# Altium schematic sheet mcu.SchDoc
size A4; SheetNumber: 2; SheetTotal: 8
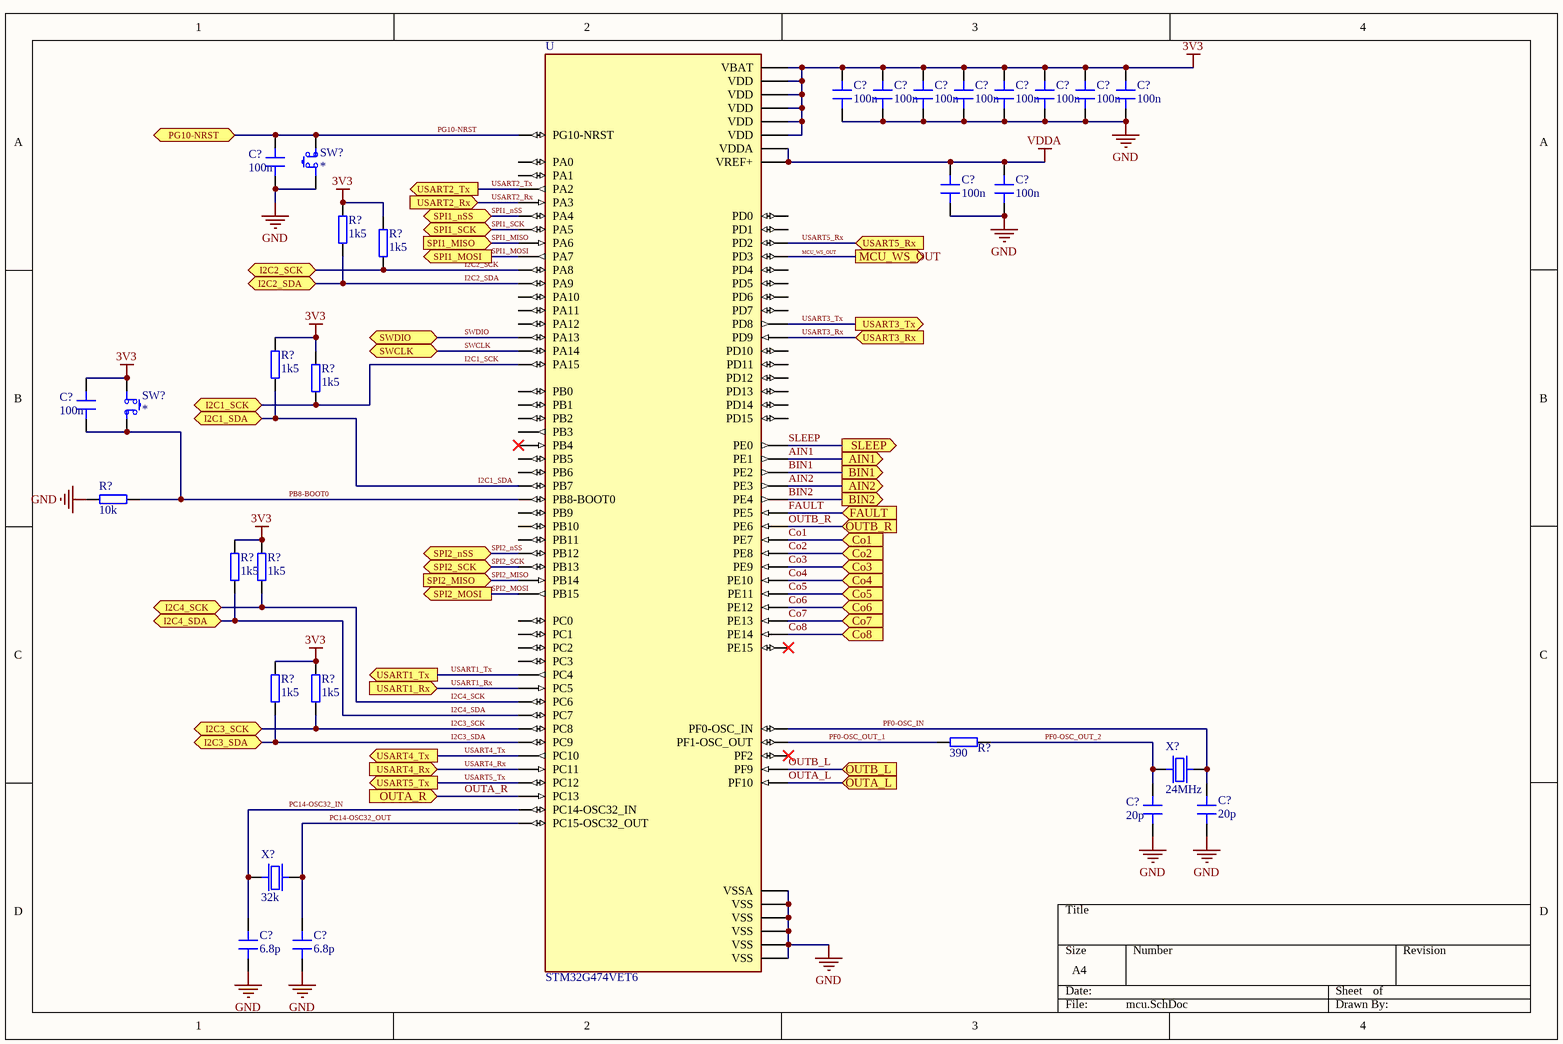
[diagram p0: mcu.SchDoc]

## Parts
(Parts that share a designator on the sheet are numbered #1, #2 ... from top to bottom, then left to right.)
C?#1  100n
C?#2  100n
C?#3  100n
C?#4  100n
C?#5  100n
C?#6  100n
C?#7  100n
C?#8  100n
C?#9  100n
C?#10  100n
C?#11  100n
C?#12  100n
C?#13  20p
C?#14  20p
C?#15  6.8p
C?#16  6.8p
R?#1  1k5
R?#2  1k5
R?#3  1k5
R?#4  1k5
R?#5  10k
R?#6  1k5
R?#7  1k5
R?#8  1k5
R?#9  1k5
R?#10  390
SW?#1  *
SW?#2  *
U  STM32G474VET6  [QFP50P1600X1600X160-100N]
X?#1  24MHz
X?#2  32k

## Ports
AIN1 (out), AIN2 (out), BIN1 (out), BIN2 (out), Co1 (in), Co2 (in), Co3 (in), Co4 (in), Co5 (in), Co6 (in), Co7 (in), Co8 (in), FAULT (in), I2C1_SCK (bidir, see mainSchema[3B]), I2C1_SDA (bidir, see mainSchema[3B]), I2C2_SCK (bidir, see mainSchema[3B]), I2C2_SDA (bidir, see mainSchema[3B]), I2C3_SCK (bidir, see mainSchema[3B]), I2C3_SDA (bidir, see mainSchema[3B]), I2C4_SCK (bidir, see mainSchema[3B]), I2C4_SDA (bidir, see mainSchema[3B]), MCU_WS_OUT (out), OUTA_L (in), OUTA_R (in), OUTB_L (in), OUTB_R (in), PG10-NRST (bidir, see mainSchema[3A]), SLEEP (out), SPI1_MISO (in, see mainSchema[3B]), SPI1_MOSI (out, see mainSchema[3C]), SPI1_nSS (bidir, see mainSchema[3B]), SPI1_SCK (bidir, see mainSchema[3B]), SPI2_MISO (in, see mainSchema[3C]), SPI2_MOSI (out, see mainSchema[3C]), SPI2_nSS (bidir, see mainSchema[3C]), SPI2_SCK (bidir, see mainSchema[3C]), SWCLK (bidir, see mainSchema[3A], SWD[2A]), SWDIO (bidir, see mainSchema[3A], SWD[2A]), USART1_Rx (in, see mainSchema[3A]), USART1_Tx (out, see mainSchema[3A]), USART2_Rx (in, see mainSchema[3A]), USART2_Tx (out, see mainSchema[3A]), USART3_Rx (in, see mainSchema[3A]), USART3_Tx (out, see mainSchema[3A]), USART4_Rx (in, see mainSchema[3A]), USART4_Tx (out, see mainSchema[3A]), USART5_Rx (in, see mainSchema[3B]), USART5_Tx (out, see mainSchema[3B])

## Nets
3V3: C?#1.2 C?#2.2 C?#3.2 C?#4.2 C?#5.2 C?#6.2 C?#7.2 C?#8.2 C?#12.1 R?#1.2 R?#2.2 R?#3.2 R?#4.2 R?#6.2 R?#7.2 R?#8.2 R?#9.2 SW?#2.1 U.6(VBAT) U.24(VDD) U.49(VDD) U.64(VDD) U.75(VDD) U.100(VDD)
GND: C?#1.1 C?#2.1 C?#3.1 C?#4.1 C?#5.1 C?#6.1 C?#7.1 C?#8.1 C?#9.2 C?#10.1 C?#11.1 C?#13.1 C?#14.1 C?#15.1 C?#16.1 R?#5.2 SW?#1.1 U.23(VSS) U.35(VSSA) U.48(VSS) U.63(VSS) U.74(VSS) U.99(VSS)
VDDA: C?#10.2 C?#11.2 U.36(VREF+) U.37(VDDA)
AIN1: U.98(PE1) ; port AIN1
AIN2: U.2(PE3) ; port AIN2
BIN1: U.1(PE2) ; port BIN1
BIN2: U.3(PE4) ; port BIN2
Co1: U.38(PE7) ; port Co1
Co2: U.39(PE8) ; port Co2
Co3: U.40(PE9) ; port Co3
Co4: U.41(PE10) ; port Co4
Co5: U.42(PE11) ; port Co5
Co6: U.43(PE12) ; port Co6
Co7: U.44(PE13) ; port Co7
Co8: U.45(PE14) ; port Co8
FAULT: U.4(PE5) ; port FAULT
I2C1_SCK: R?#4.1 U.78(PA15) ; port I2C1_SCK
I2C1_SDA: R?#3.1 U.94(PB7) ; port I2C1_SDA
I2C2_SCK: R?#2.1 U.69(PA8) ; port I2C2_SCK
I2C2_SDA: R?#1.1 U.70(PA9) ; port I2C2_SDA
I2C3_SCK: R?#9.1 U.67(PC8) ; port I2C3_SCK
I2C3_SDA: R?#8.1 U.68(PC9) ; port I2C3_SDA
I2C4_SCK: R?#7.1 U.65(PC6) ; port I2C4_SCK
I2C4_SDA: R?#6.1 U.66(PC7) ; port I2C4_SDA
MCU_WS_OUT: U.85(PD3) ; port MCU_WS_OUT
OUTA_L: U.11(PF10) ; port OUTA_L
OUTA_R: U.7(PC13) ; port OUTA_R
OUTB_L: U.10(PF9) ; port OUTB_L
OUTB_R: U.5(PE6) ; port OUTB_R
PB8-BOOT0: C?#12.2 R?#5.1 SW?#2.2 U.95(PB8-BOOT0)
PC14-OSC32_IN: C?#15.2 U.8(PC14-OSC32_IN) X?#2.1
PC14-OSC32_OUT: C?#16.2 U.9(PC15-OSC32_OUT) X?#2.2
PF0-OSC_IN: C?#14.2 U.12(PF0-OSC_IN) X?#1.2
PF0-OSC_OUT_1: R?#10.1 U.13(PF1-OSC_OUT)
PF0-OSC_OUT_2: C?#13.2 R?#10.2 X?#1.1
PG10-NRST: C?#9.1 SW?#1.2 U.14(PG10-NRST) ; port PG10-NRST
SLEEP: U.97(PE0) ; port SLEEP
SPI1_MISO: U.28(PA6) ; port SPI1_MISO
SPI1_MOSI: U.29(PA7) ; port SPI1_MOSI
SPI1_nSS: U.26(PA4) ; port SPI1_nSS
SPI1_SCK: U.27(PA5) ; port SPI1_SCK
SPI2_MISO: U.53(PB14) ; port SPI2_MISO
SPI2_MOSI: U.54(PB15) ; port SPI2_MOSI
SPI2_nSS: U.51(PB12) ; port SPI2_nSS
SPI2_SCK: U.52(PB13) ; port SPI2_SCK
SWCLK: U.77(PA14) ; port SWCLK
SWDIO: U.76(PA13) ; port SWDIO
USART1_Rx: U.31(PC5) ; port USART1_Rx
USART1_Tx: U.30(PC4) ; port USART1_Tx
USART2_Rx: U.25(PA3) ; port USART2_Rx
USART2_Tx: U.22(PA2) ; port USART2_Tx
USART3_Rx: U.56(PD9) ; port USART3_Rx
USART3_Tx: U.55(PD8) ; port USART3_Tx
USART4_Rx: U.80(PC11) ; port USART4_Rx
USART4_Tx: U.79(PC10) ; port USART4_Tx
USART5_Rx: U.84(PD2) ; port USART5_Rx
USART5_Tx: U.81(PC12) ; port USART5_Tx

Not connected (* = marked no-connect by the designer): U 15(PC0) 16(PC1) 17(PC2) 18(PC3) 19(PF2)* 20(PA0) 21(PA1) 32(PB0) 33(PB1) 34(PB2) 46(PE15)* 47(PB10) 50(PB11) 57(PD10) 58(PD11) 59(PD12) 60(PD13) 61(PD14) 62(PD15) 71(PA10) 72(PA11) 73(PA12) 82(PD0) 83(PD1) 86(PD4) 87(PD5) 88(PD6) 89(PD7) 90(PB3) 91(PB4)* 92(PB5) 93(PB6) 96(PB9)

## Notes on the sheet
- (near C?#3) 100nF for each VDD pin
- (near R?#5) Main Flash memory is selected as boot area when GND. When 3V3 Embedded SRAM1 isselected as boot area

## Library data of the parts
C?#1-C?#16 = Capacitor: Value: *; HelpURL: *; MPN: *; Supplier: *; SupplierPartNumber: *
R?#1-R?#10 = Resistor: Value: *; HelpURL: *; MPN: *; Supplier: *; SupplierPartNumber: *
SW?#1 SW?#2 = Switch: Value: *; HelpURL: *; MPN: *; Supplier: *; SupplierPartNumber: *
U = STM32G474VET6: ARMÂ® CortexÂ®-M4F STM32G4 Microcontroller IC 32-Bit 170MHz 512KB _512K x 8_ FLASH 100-LQFP _14x14_; MF: STMicroelectronics; MP: STM32G474VET6; Value: *; Package: LQFP-100 STMicroelectronics; Availability: Unavailable; Price: None; SnapEDA_Link: https://www.snapeda.com/parts/STM32G474VET6/STMicroelectronics/view-part/3664237/?ref=snap
X?#1 X?#2 = Crystal: Value: *; HelpURL: *; MPN: *; Supplier: *; SupplierPartNumber: *